# EAGLE design 7segement4digits1badidea-max7219-smd-mk-1.0 (EAGLE 6.5.0)
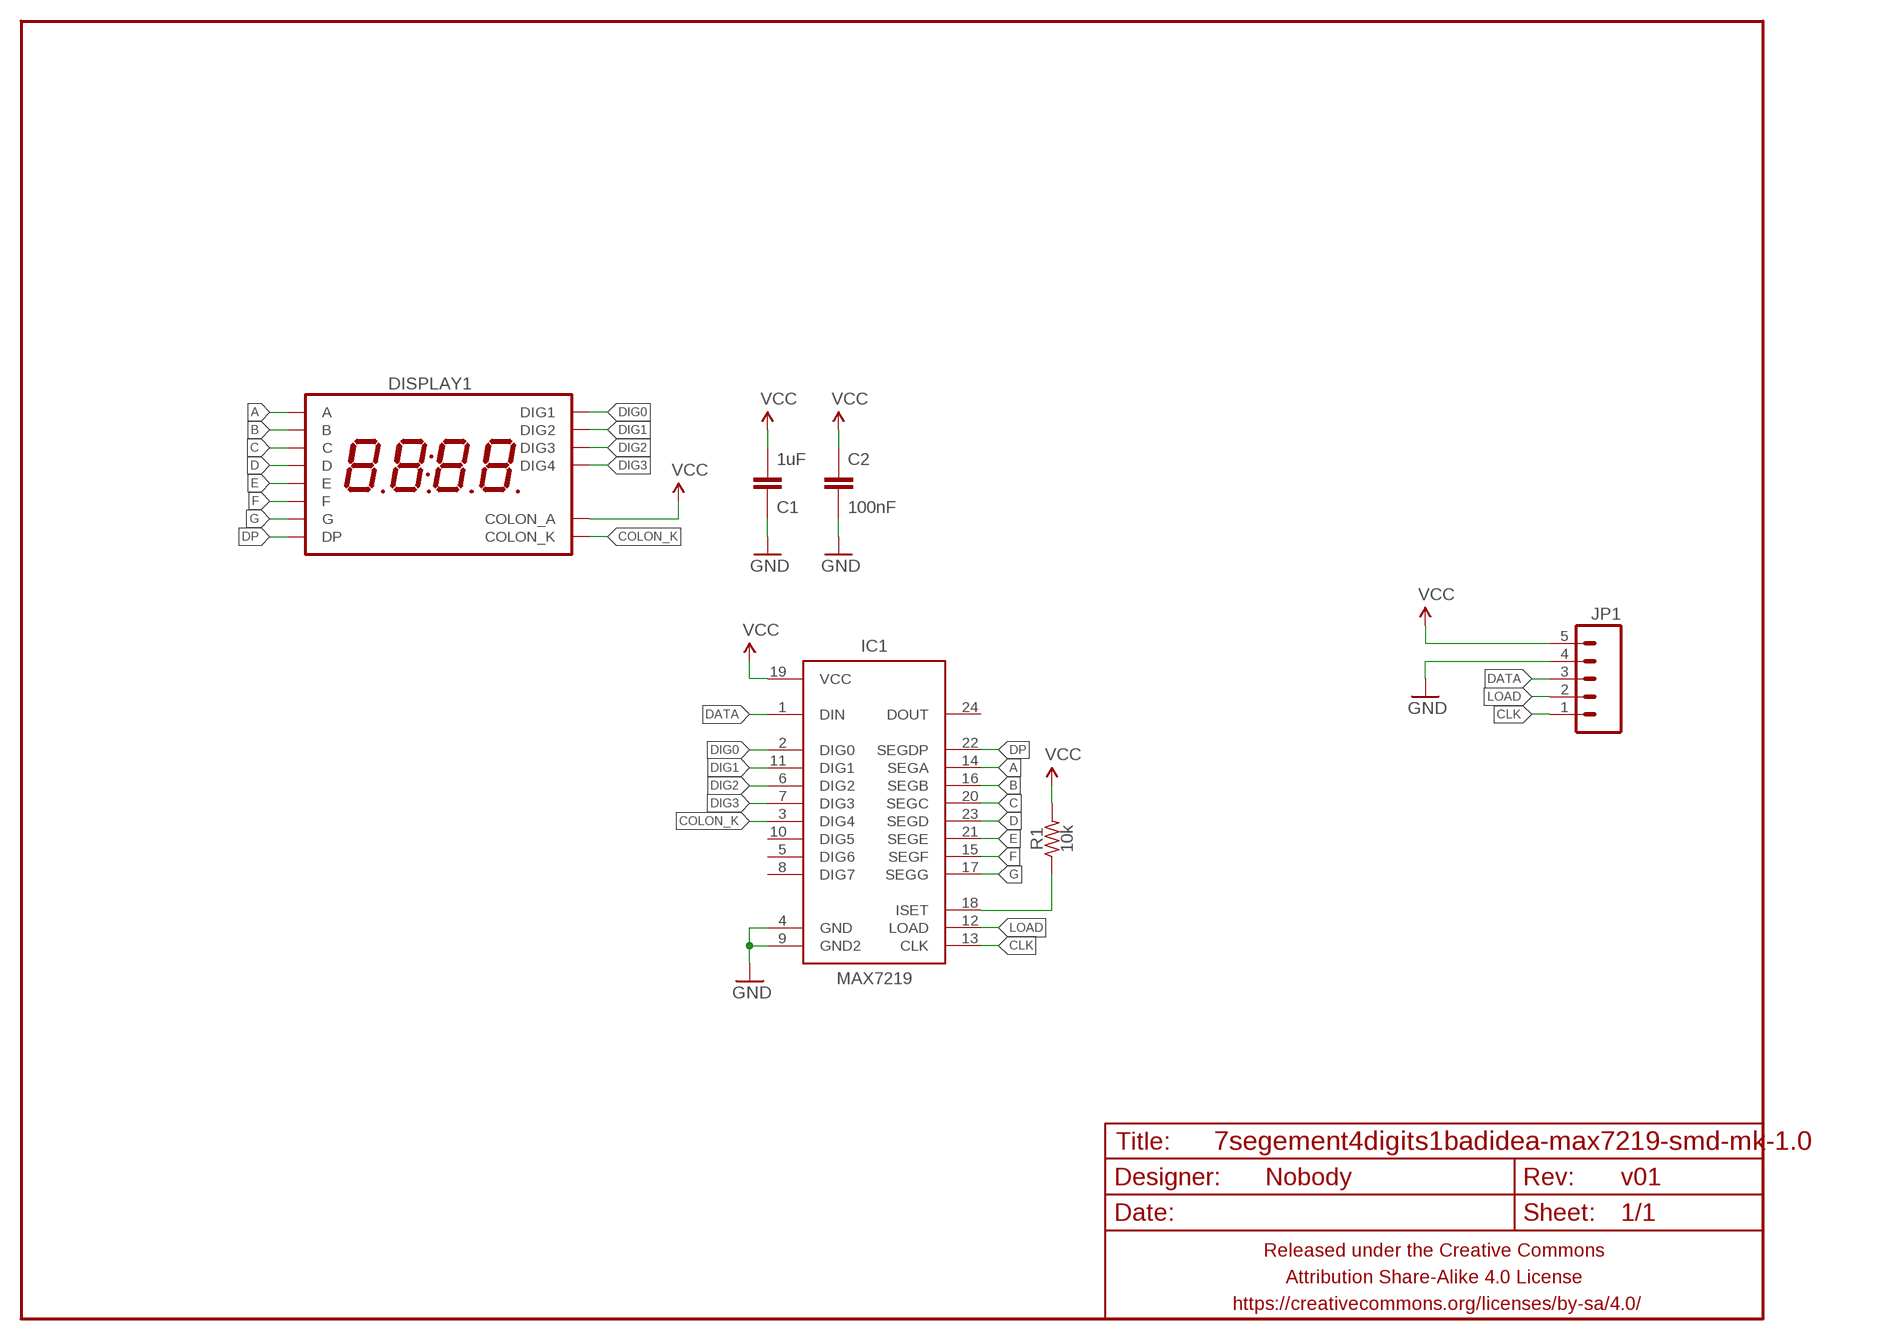
[diagram p0: schematic, sheet 1]

## Parts
C1  1uF  CAPACITOR-CERAMICC0805  [C0805]
C2  100nF  CAPACITOR-CERAMICC0805  [C0805]
DISPLAY1  7SEG_4DIGIT_COLONADAFRUIT_0.56IN  [7SEG_4DIG]
FRAME1  FRAME-LETTERNO_PACKAGE  [DUMMY]
IC1  MAX7219  MAX7219SOIC-W  [SO24W]
JP1  M05JST-PH-VERT-PTH  [JST-5-PH-VERT-PTH]
R1  10k  RESISTORR0805  [R0805]

## Nets
A: DISPLAY1.P$13(A) IC1.14(SEGA)
B: DISPLAY1.P$9(B) IC1.16(SEGB)
C: DISPLAY1.P$4(C) IC1.20(SEGC)
CLK: IC1.13(CLK) JP1.1
COLON_K: DISPLAY1.P$7(COLON_K) IC1.3(DIG4)
D: DISPLAY1.P$2(D) IC1.23(SEGD)
DATA: IC1.1(DIN) JP1.3
DIG0: DISPLAY1.P$14(DIG1) IC1.2(DIG0)
DIG1: DISPLAY1.P$11(DIG2) IC1.11(DIG1)
DIG2: DISPLAY1.P$10(DIG3) IC1.6(DIG2)
DIG3: DISPLAY1.P$6(DIG4) IC1.7(DIG3)
DP: DISPLAY1.P$3(DP) IC1.22(SEGDP)
E: DISPLAY1.P$1(E) IC1.21(SEGE)
F: DISPLAY1.P$12(F) IC1.15(SEGF)
G: DISPLAY1.P$5(G) IC1.17(SEGG)
GND: C1.1 C2.2 IC1.4(GND) IC1.9(GND2) JP1.4
LOAD: IC1.12(LOAD) JP1.2
N$1: IC1.18(ISET) R1.1
VCC: C1.2 C2.1 DISPLAY1.P$8(COLON_A) IC1.19(VCC) JP1.5 R1.2
Unconnected: IC1.5(DIG6) IC1.8(DIG7) IC1.10(DIG5) IC1.24(DOUT)

## Library data of the parts
C1 C2 = A_butts:CAPACITOR-CERAMIC: CAPACITOR, European symbol
DISPLAY1 = A_butts:7SEG_4DIGIT_COLON
FRAME1 = A_butts:FRAME-LETTER: Schematic Frame Standard 8.5x11 US Letter frame; DESIGNER: Nobody; VERSION: v01
IC1 = A_butts:MAX7219: 8-digit, 8-segment LED display driver, serial input
JP1 = A_butts:M05: Header 5 Standard 5-pin 0.1" header. Use with straight break away headers (SKU : PRT-00116), right angle break away headers (PRT-00553), swiss pins (PRT-00743), machine pins (PRT-00117), and female headers (PRT-00115). Molex polarized connector foot print use with SKU : PRT-08230 with associated crimp pins and housings.
R1 = A_butts:RESISTOR: RESISTOR, American symbol

## Board
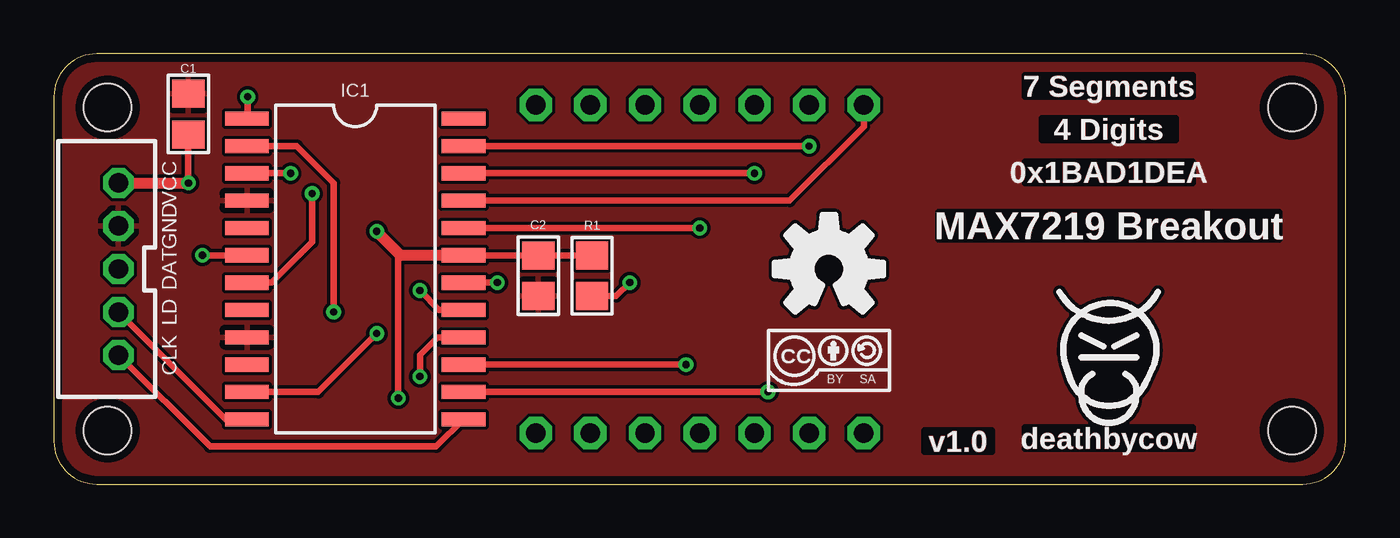
[diagram p1: board, top side]
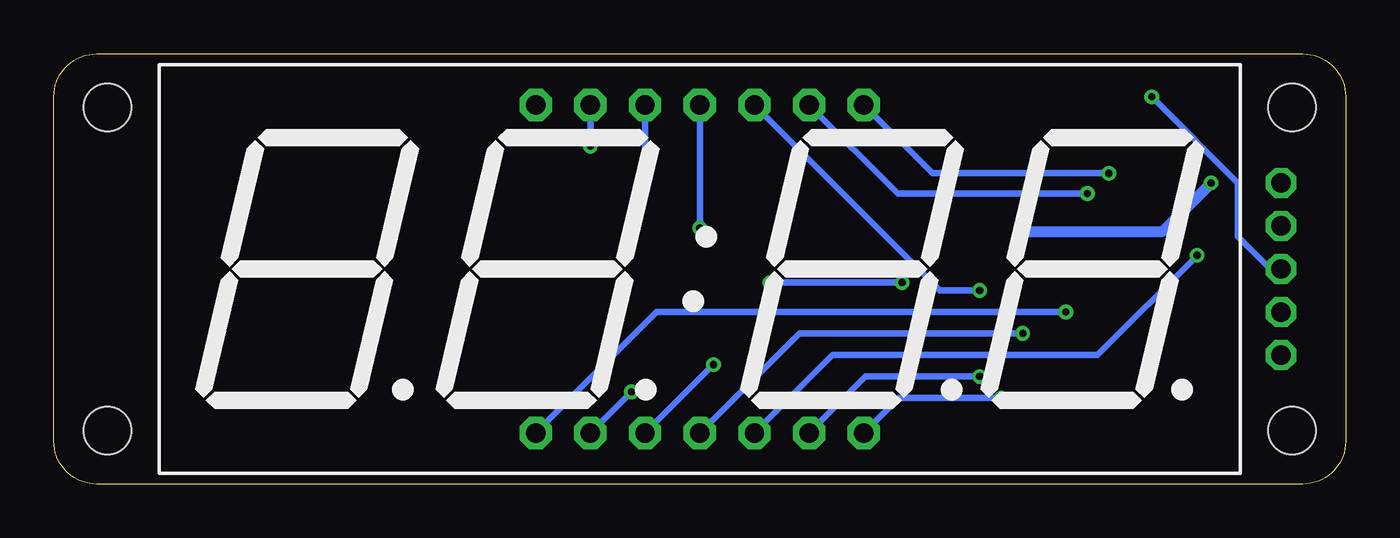
[diagram p2: board, bottom side, seen from below]

Size 60 x 20 mm. Coordinates in mm from the lower left corner, seen from the top.
Outline: 0,18 0,2 arc90 2,0 58,0 arc90 60,2 60,18 arc90 58,20 2,20 arc90 0,18
Copper layers (1*16): Top 0.0356mm / dielectric 1.5011mm / Bottom 0.0356mm
Design rules "LaenPCBOrder2": minimum track width 6mil, minimum drill 13mil, track to track 6mil, track to pad 6mil, pad to pad 6mil, via to via 6mil, smd to smd 6mil, copper to edge 15mil, drill to drill 6mil, minimum pad ring 7mil, minimum via ring 7mil, stop-mask expansion 3mil, vias tented up to drill 20mil, thermal gap 10mil
Holes 2.2 mm at 2.5,17.5 2.5,2.5 57.5,2.5 57.5,17.5

### Footprints (pad centres in the part's own frame; a part is rotated, then mirrored left to right if it is on the bottom)
C0805 = smd 1.3 x 1.5: 1 -0.95,0; 2 0.95,0
7SEG_4DIG = drill 0.9 pad 1.5 octagon: P$1 -7.62,7.62; P$2 -5.08,7.62; P$3 -2.54,7.62; P$4 0,7.62; P$5 2.54,7.62; P$6 5.08,7.62; P$7 7.62,7.62; P$8 7.62,-7.62; P$9 5.08,-7.62; P$10 2.54,-7.62; P$11 0,-7.62; P$12 -2.54,-7.62; P$13 -5.08,-7.62; P$14 -7.62,-7.62
SO24W = smd 0.66 x 2.032: 1 -6.985,-5.029; 2 -5.715,-5.029; 3 -4.445,-5.029; 4 -3.175,-5.029; 5 -1.905,-5.029; 6 -0.635,-5.029; 7 0.635,-5.029; 8 1.905,-5.029; 9 3.175,-5.029; 10 4.445,-5.029; 11 5.715,-5.029; 12 6.985,-5.029; 13 6.985,5.029; 14 5.715,5.029; 15 4.445,5.029; 16 3.175,5.029; 17 1.905,5.029; 18 0.635,5.029; 19 -0.635,5.029; 20 -1.905,5.029; 21 -3.175,5.029; 22 -4.445,5.029; 23 -5.715,5.029; 24 -6.985,5.029
JST-5-PH-VERT-PTH = drill 0.9 pad 1.4 octagon: 1 -4,0; 2 -2,0; 3 0,0; 4 2,0; 5 4,0
R0805 = smd 1.3 x 1.5: 1 -0.95,0; 2 0.95,0

### Placement (x,y rotation side)
C1  6.25,17.2 270 top
C2  22.5,9.69 270 top
DISPLAY1  30,10 0 bottom
FRAME1  0,0 0 top
IC1  14,10 270 top
JP1  3,10 90 top
R1  25,9.69 90 top
U$1  [CC-BY-SA-4.0-NO-URL]  36,5.75 0 top
U$2  [COW_SMALL_METAL]  49,6.4 0 top
U$3  [OSHWLOGO_TOP_0.2_A]  36,10 0 top

### Tracks (layer width: path | path; a pad name or v marks a point on that pad's centre or on a via)
A  (via drill 0.33)
  Top 0.3: v33.17,4.29 IC1.14
  Bottom 0.3: DISPLAY1.P$13 v33.17,4.29
B  (via drill 0.33)
  Top 0.3: v17,5 17,6 17.82,6.83 IC1.16
  Bottom 0.3: DISPLAY1.P$9 22.3,5 v17,5
C  (via drill 0.33)
  Top 0.3: IC1.20 v30,11.9
  Bottom 0.3: DISPLAY1.P$4 v30,11.9
CLK
  Top 0.3: IC1.13 17.76,1.75 7.25,1.75 JP1.1
COLON_K  (via drill 0.33)
  Top 0.3: IC1.3 v11,14.45
  Bottom 0.3: v11,14.45 19.2,14.45 DISPLAY1.P$7
D  (via drill 0.33)
  Top 0.3: v35.08,15.71 IC1.23
  Bottom 0.3: DISPLAY1.P$2 v35.08,15.71
DATA  (via drill 0.33)
  Top 0.3: IC1.1 9,17.01 v9,18
  Bottom 0.3: v9,18 5,14 5,11.5 3.5,10 JP1.3
DIG0  (via drill 0.33)
  Top 0.3: v13,8 13,14 11.29,15.71 IC1.2
  Bottom 0.3: DISPLAY1.P$14 32,8 v13,8
DIG1  (via drill 0.33)
  Top 0.3: v15,7 12.29,4.29 IC1.11
  Bottom 0.3: DISPLAY1.P$11 25.38,7 v15,7
DIG2  (via drill 0.33)
  Top 0.3: IC1.6 v6.9,10.63
  Bottom 0.3: DISPLAY1.P$10 23.84,6 11.54,6 v6.9,10.63
DIG3  (via drill 0.33)
  Top 0.3: v12,13.5 12,11.25 10.12,9.37 IC1.7
  Bottom 0.3: DISPLAY1.P$6 20.8,13.5 v12,13.5
DP  (via drill 0.33)
  Top 0.3: v32.54,14.45 IC1.22
  Bottom 0.3: DISPLAY1.P$3 v32.54,14.45
E
  Top 0.3: IC1.21 34.17,13.18 37.62,16.62 DISPLAY1.P$1
F  (via drill 0.33)
  Top 0.3: IC1.15 v29.36,5.55
  Bottom 0.3: v29.36,5.55 DISPLAY1.P$12
G  (via drill 0.33)
  Top 0.3: IC1.17 17.91,8.1 v17,9
  Bottom 0.3: v17,9 18.84,9 DISPLAY1.P$5
GND
  pour Top: -0.1,20.1 60.1,20.1 60.1,-0.1 -0.1,-0.1
LOAD
  Top 0.3: IC1.12 8.96,3 8,3 JP1.2
N$1  (via drill 0.33)
  Top 0.3: IC1.18 v20.6,9.37 | v26.75,9.37 26.12,8.73 R1.1
  Bottom 0.3: v20.6,9.37 v26.75,9.37
VCC  (via drill 0.33)
  Top 0.3: v6.25,14 C1.2 | R1.2 C2.1 IC1.19 | v16,4 16,10.52 16.11,10.63
  Top 0.5: JP1.5 v6.25,14 | IC1.19 16.11,10.63 v15,11.75
  Bottom 0.3: DISPLAY1.P$8 20.76,4 v16,4
  Bottom 0.5: v15,11.75 8.5,11.75 v6.25,14

### Text on the board
Top: 7 Segments | 4 Digits | 0x1BAD1DEA | MAX7219 Breakout
tPlace: 7 Segments | 4 Digits | VCC | 0x1BAD1DEA | GND | MAX7219 Breakout | DAT | LD | CLK